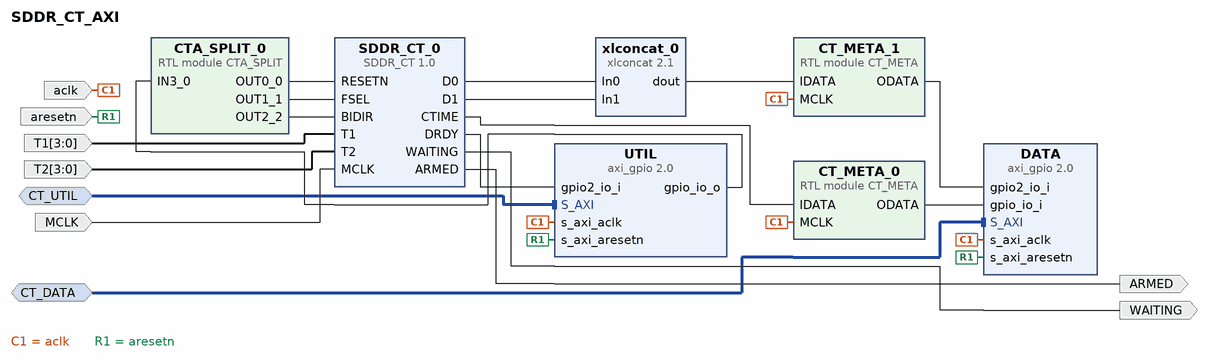
[diagram p0: block diagram of the top level]
# Vivado block design SDDR_CT_AXI, xc7z020clg400-1, Vivado 2019.1
create_bd_design SDDR_CT_AXI

create_bd_intf_port -mode Slave -vlnv xilinx.com:interface:aximm_tlm:1.0 CT_DATA
create_bd_intf_port -mode Slave -vlnv xilinx.com:interface:aximm_tlm:1.0 CT_UTIL
create_bd_port -dir O WAITING
create_bd_port -dir O ARMED
create_bd_port -dir I -from 3 -to 0 T1
create_bd_port -dir I -from 3 -to 0 T2
create_bd_port -dir I -type clk MCLK
set_property -dict {CONFIG.FREQ_HZ 400000000} [get_bd_ports MCLK]
create_bd_port -dir I -type clk aclk
set_property -dict {CONFIG.FREQ_HZ 100000000} [get_bd_ports aclk]
create_bd_port -dir I -type rst aresetn

create_bd_cell -type ip -vlnv cri.nz:user:SDDR_CT:1.0 SDDR_CT_0
set_property -dict {CONFIG.SIG_WIDTH 4} [get_bd_cells SDDR_CT_0]
create_bd_cell -type ip -vlnv xilinx.com:ip:axi_gpio:2.0 DATA
set_property -dict {CONFIG.C_ALL_INPUTS 1 CONFIG.C_ALL_INPUTS_2 1 CONFIG.C_GPIO2_WIDTH 16 CONFIG.C_IS_DUAL 1} [get_bd_cells DATA]
create_bd_cell -type ip -vlnv xilinx.com:ip:xlconcat:2.1 xlconcat_0
create_bd_cell -type ip -vlnv xilinx.com:ip:axi_gpio:2.0 UTIL
set_property -dict [list \
  CONFIG.C_ALL_INPUTS_2 1 \
  CONFIG.C_ALL_OUTPUTS 1 \
  CONFIG.C_GPIO2_WIDTH 1 \
  CONFIG.C_GPIO_WIDTH 3 \
  CONFIG.C_IS_DUAL 1 \
] [get_bd_cells UTIL]
create_bd_cell -type module -reference CTA_SPLIT CTA_SPLIT_0
create_bd_cell -type module -reference CT_META CT_META_0
set_property -dict {CONFIG.g_width 32} [get_bd_cells CT_META_0]
create_bd_cell -type module -reference CT_META CT_META_1
set_property -dict {CONFIG.g_width 16} [get_bd_cells CT_META_1]

# ---- connections ----

connect_bd_intf_net [get_bd_intf_ports CT_UTIL] [get_bd_intf_pins UTIL/S_AXI]
connect_bd_intf_net [get_bd_intf_ports CT_DATA] [get_bd_intf_pins DATA/S_AXI]
connect_bd_net [get_bd_pins SDDR_CT_0/D0] [get_bd_pins xlconcat_0/In0]
connect_bd_net [get_bd_pins SDDR_CT_0/D1] [get_bd_pins xlconcat_0/In1]
connect_bd_net [get_bd_pins UTIL/gpio_io_o] [get_bd_pins CTA_SPLIT_0/IN3_0]
connect_bd_net [get_bd_pins CTA_SPLIT_0/OUT0_0] [get_bd_pins SDDR_CT_0/RESETN]
connect_bd_net [get_bd_pins CTA_SPLIT_0/OUT1_1] [get_bd_pins SDDR_CT_0/FSEL]
connect_bd_net [get_bd_pins CTA_SPLIT_0/OUT2_2] [get_bd_pins SDDR_CT_0/BIDIR]
connect_bd_net [get_bd_pins SDDR_CT_0/DRDY] [get_bd_pins UTIL/gpio2_io_i]
connect_bd_net [get_bd_pins SDDR_CT_0/WAITING] [get_bd_ports WAITING]
connect_bd_net [get_bd_pins SDDR_CT_0/ARMED] [get_bd_ports ARMED]
connect_bd_net -net T1_1 [get_bd_ports T1] [get_bd_pins SDDR_CT_0/T1]
connect_bd_net -net T2_1 [get_bd_ports T2] [get_bd_pins SDDR_CT_0/T2]
connect_bd_net [get_bd_ports MCLK] [get_bd_pins SDDR_CT_0/MCLK]
connect_bd_net [get_bd_ports aclk] \
  [get_bd_pins UTIL/s_axi_aclk] [get_bd_pins DATA/s_axi_aclk] [get_bd_pins CT_META_0/MCLK] [get_bd_pins CT_META_1/MCLK]
connect_bd_net [get_bd_ports aresetn] [get_bd_pins UTIL/s_axi_aresetn] [get_bd_pins DATA/s_axi_aresetn]
connect_bd_net [get_bd_pins SDDR_CT_0/CTIME] [get_bd_pins CT_META_0/IDATA]
connect_bd_net [get_bd_pins CT_META_0/ODATA] [get_bd_pins DATA/gpio_io_i]
connect_bd_net [get_bd_pins xlconcat_0/dout] [get_bd_pins CT_META_1/IDATA]
connect_bd_net [get_bd_pins CT_META_1/ODATA] [get_bd_pins DATA/gpio2_io_i]

validate_bd_design
save_bd_design
